# Altium schematic sheet MCU_Con.SchDoc
size A4; SheetNumber: 3; SheetTotal: 3
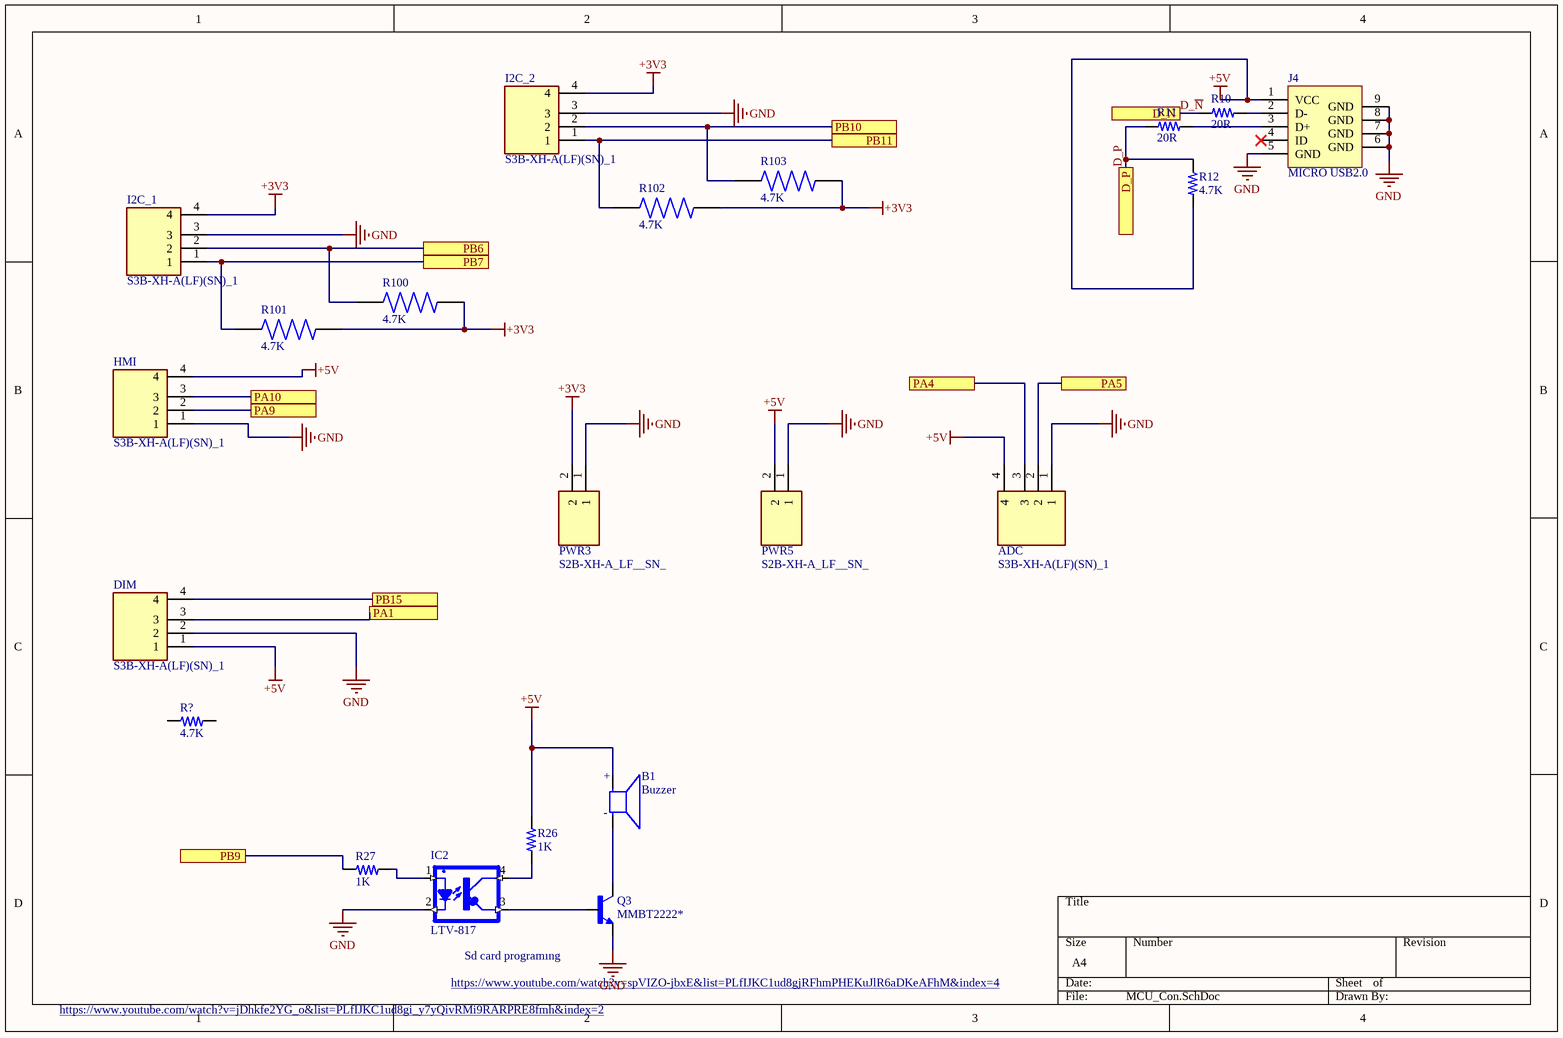
[diagram p0: MCU_Con.SchDoc]

## Parts
ADC  S3B-XH-A(LF)(SN)_1  [JST_S4B-XH-A(LF)(SN)]
B1  Buzzer  [BUZZ]
DIM  S3B-XH-A(LF)(SN)_1  [JST_S4B-XH-A(LF)(SN)]
HMI  S3B-XH-A(LF)(SN)_1  [JST_S4B-XH-A(LF)(SN)]
I2C_1  S3B-XH-A(LF)(SN)_1  [JST_S4B-XH-A(LF)(SN)]
I2C_2  S3B-XH-A(LF)(SN)_1  [JST_S4B-XH-A(LF)(SN)]
IC2  LTV-817  [OPTO]
J4  MICRO USB2.0  [CON_10118192-0001LF_SMD]
PWR3  S2B-XH-A_LF__SN_  [SHDRRA2W80P0X250_1X2_740X1150X610P]
PWR5  S2B-XH-A_LF__SN_  [SHDRRA2W80P0X250_1X2_740X1150X610P]
Q3  MMBT2222*  [SOT23-BEC]
R10  20R  [RES_0805]
R11  20R  [RES_0805]
R12  4.7K  [RES_0805]
R26  1K  [RES_0805]
R27  1K  [RES_0805]
R100  4.7K  [RES0805]
R101  4.7K  [RES0805]
R102  4.7K  [RES0805]
R103  4.7K  [RES0805]
R?  4.7K  [RES_0805]

## Ports
D_N, D_P, PA1, PA4, PA5, PA9, PA10, PB6, PB7, PB9, PB10, PB11, PB15

## Nets
+3V3: I2C_1.4 I2C_2.4 PWR3.2 R100.1 R101.1 R102.1 R103.1
+5V: ADC.4 B1.P DIM.1 HMI.4 J4.1(VCC) PWR5.2 R12.1 R26.2
GND: ADC.1 DIM.2 HMI.1 I2C_1.3 I2C_2.3 IC2.2 J4.5(GND) J4.6(GND) J4.7(GND) J4.8(GND) J4.9(GND) PWR3.1 PWR5.1 Q3.E
D_~{N}: R10.1 ; port D_N
D_P: R11.1 R12.2 ; port D_P
PA1: DIM.3 ; port PA1
PA4: ADC.3 ; port PA4
PA5: ADC.2 ; port PA5
PA9: HMI.2 ; port PA9
PA10: HMI.3 ; port PA10
PB6: I2C_1.2 R100.2 ; port PB6
PB7: I2C_1.1 R101.2 ; port PB7
PB9: R27.2 ; port PB9
PB10: I2C_2.2 R103.2 ; port PB10
PB11: I2C_2.1 R102.2 ; port PB11
PB15: DIM.4 ; port PB15
NetB1_N: B1.N Q3.C
NetIC2_1: IC2.1 R27.1
NetIC2_3: IC2.3 Q3.B
NetIC2_4: IC2.4 R26.1
NetJ4_2: J4.2(D-) R10.2
NetJ4_3: J4.3(D+) R11.2

Not connected (* = marked no-connect by the designer): J4 4(ID)*; R? 1 2

## Notes on the sheet
- https://www.youtube.com/watch?v=spVIZO-jbxE&list=PLfIJKC1ud8gjRFhmPHEKuJlR6aDKeAFhM&index=4
- Sd card programıng
- https://www.youtube.com/watch?v=jDhkfe2YG_o&list=PLfIJKC1ud8gi_y7yQivRMi9RARPRE8fmh&index=2
- (in symbol Buzzer) +; -

## Library data of the parts
ADC DIM HMI I2C_1 I2C_2 = S3B-XH-A(LF)(SN)_1: Connector Header Through Hole, Right Angle 3 position 0.098 (2.50mm); MF: JST Sales; Purchase-URL: https://pricing.snapeda.com/search/part/S3B-XH-A(LF)(SN)/?ref=eda; Check_prices: https://www.snapeda.com/parts/S3B-XH-A(LF)(SN)/JST+Sales+America+Inc./view-part/?ref=eda; Package: Custom Package JST Sales; SnapEDA_Link: https://www.snapeda.com/parts/S3B-XH-A(LF)(SN)/JST+Sales+America+Inc./view-part/?ref=snap; Value: *; MP: S3B-XH-A(LF)(SN); Digi-Key_Part_Number: 455-2250-ND
B1 = Buzzer: 9.6 mm, 3 Vdc, 80 dB, Through Hole, Driving Circuit, Magnetic Audio Indicator Buzzer; MP: CMI-9605IC-0380T; MF: CUI Devices; Availability: Unavailable; SnapEDA_Link: https://www.snapeda.com/parts/CMI-9605IC-0380T/CUI%20Devices/view-part/4413414/?ref=snap; Value: *; Package: Package; Price: None
IC2 = LTV-817: Optoisolator Transistor Output 5000Vrms 1 Channel 4-SMD; MF: Lite-On Electronics; SnapEDA_Link: https://www.snapeda.com/parts/LTV-817/ICS/view-part/4478599/?ref=snap; Price: None; MP: LTV-817; Value: *; Availability: Unavailable; Package: DIP-4 Lite-On Electronics
J4 = CON-USB_10118192-0002LF-SMD: USB - micro B USB 2.0 Receptacle Connector 5 Position Surface Mount, Right Angle; Manufacturer: Amphenol ICC (FCI); Manufacturing Part Number: 10118192-0002LF; Case/Package: SMD; Supplier-1: Digikey; Supplier Part Number-1: 609-5379-1-ND
PWR3 PWR5 = S2B-XH-A_LF__SN_: XH-2.5mm Header side entry 2 way JST XH Series, Series Number S2B, 2.5mm Pitch 2 Way 1 Row Right Angle PCB Header, Solder Termination, 3A; Manufacturer_Name: JST (JAPAN SOLDERLESS TERMINALS); Manufacturer_Part_Number: S2B-XH-A(LF)(SN); Geometry.Height: 6.1mm; Mouser Part Number: *; Mouser Price/Stock: *; Arrow Part Number: S2B-XH-A(LF)(SN); Arrow Price/Stock: https://www.arrow.com/en/products/s2b-xh-a-lf-sn/jst-manufacturing?region=europe; Datasheet Link: http://www.jst-mfg.com/product/pdf/eng/eXH.pdf
Q3 = MMBT2222*: <b>NPN Transistor</b>; MP: MMBT2222-; MF: {'manufacturer': u'ON Semiconductor'}; Package: None; Price: None; Availability: Unavailable; Value: *
R10-R12 R26 R27 R? = RES_1K-0.125W-1%-0805: 1 kOhms ±1% 0.125W, 1/8W Chip Resistor 0805 (2012 Metric) Moisture Resistant Thick Film; Manufacturer: 垈㎵á; Manufacturer Part Number: RC0805FR-071KL; Case/Package: 0805; Supplier-1: Digikey; Supplier Part Number-1: 311-1.00KCRCT-ND
R100-R103 = RES0805: 910 Ohms Â±1% 0.125W, 1/8W Chip Resistor 0805 _2012 Metric_ Moisture Resistant Thick Film; MF: Yageo; MP: RC0805FR-07910RL; Package: 2012 Rohm Semiconductor; Availability: Unavailable; Value: *; SnapEDA_Link: https://www.snapeda.com/parts/RC0805FR-07910RL/Yageo/view-part/106117/?ref=snap; Price: None